# Altium schematic sheet FPGA_Actel_ProASICPlus_Evaluation_Board_Rev1_0.SchDoc: Example for Actel ProASIC+ Board
size B; DocumentNumber: 1; SheetNumber: 1; SheetTotal: 1
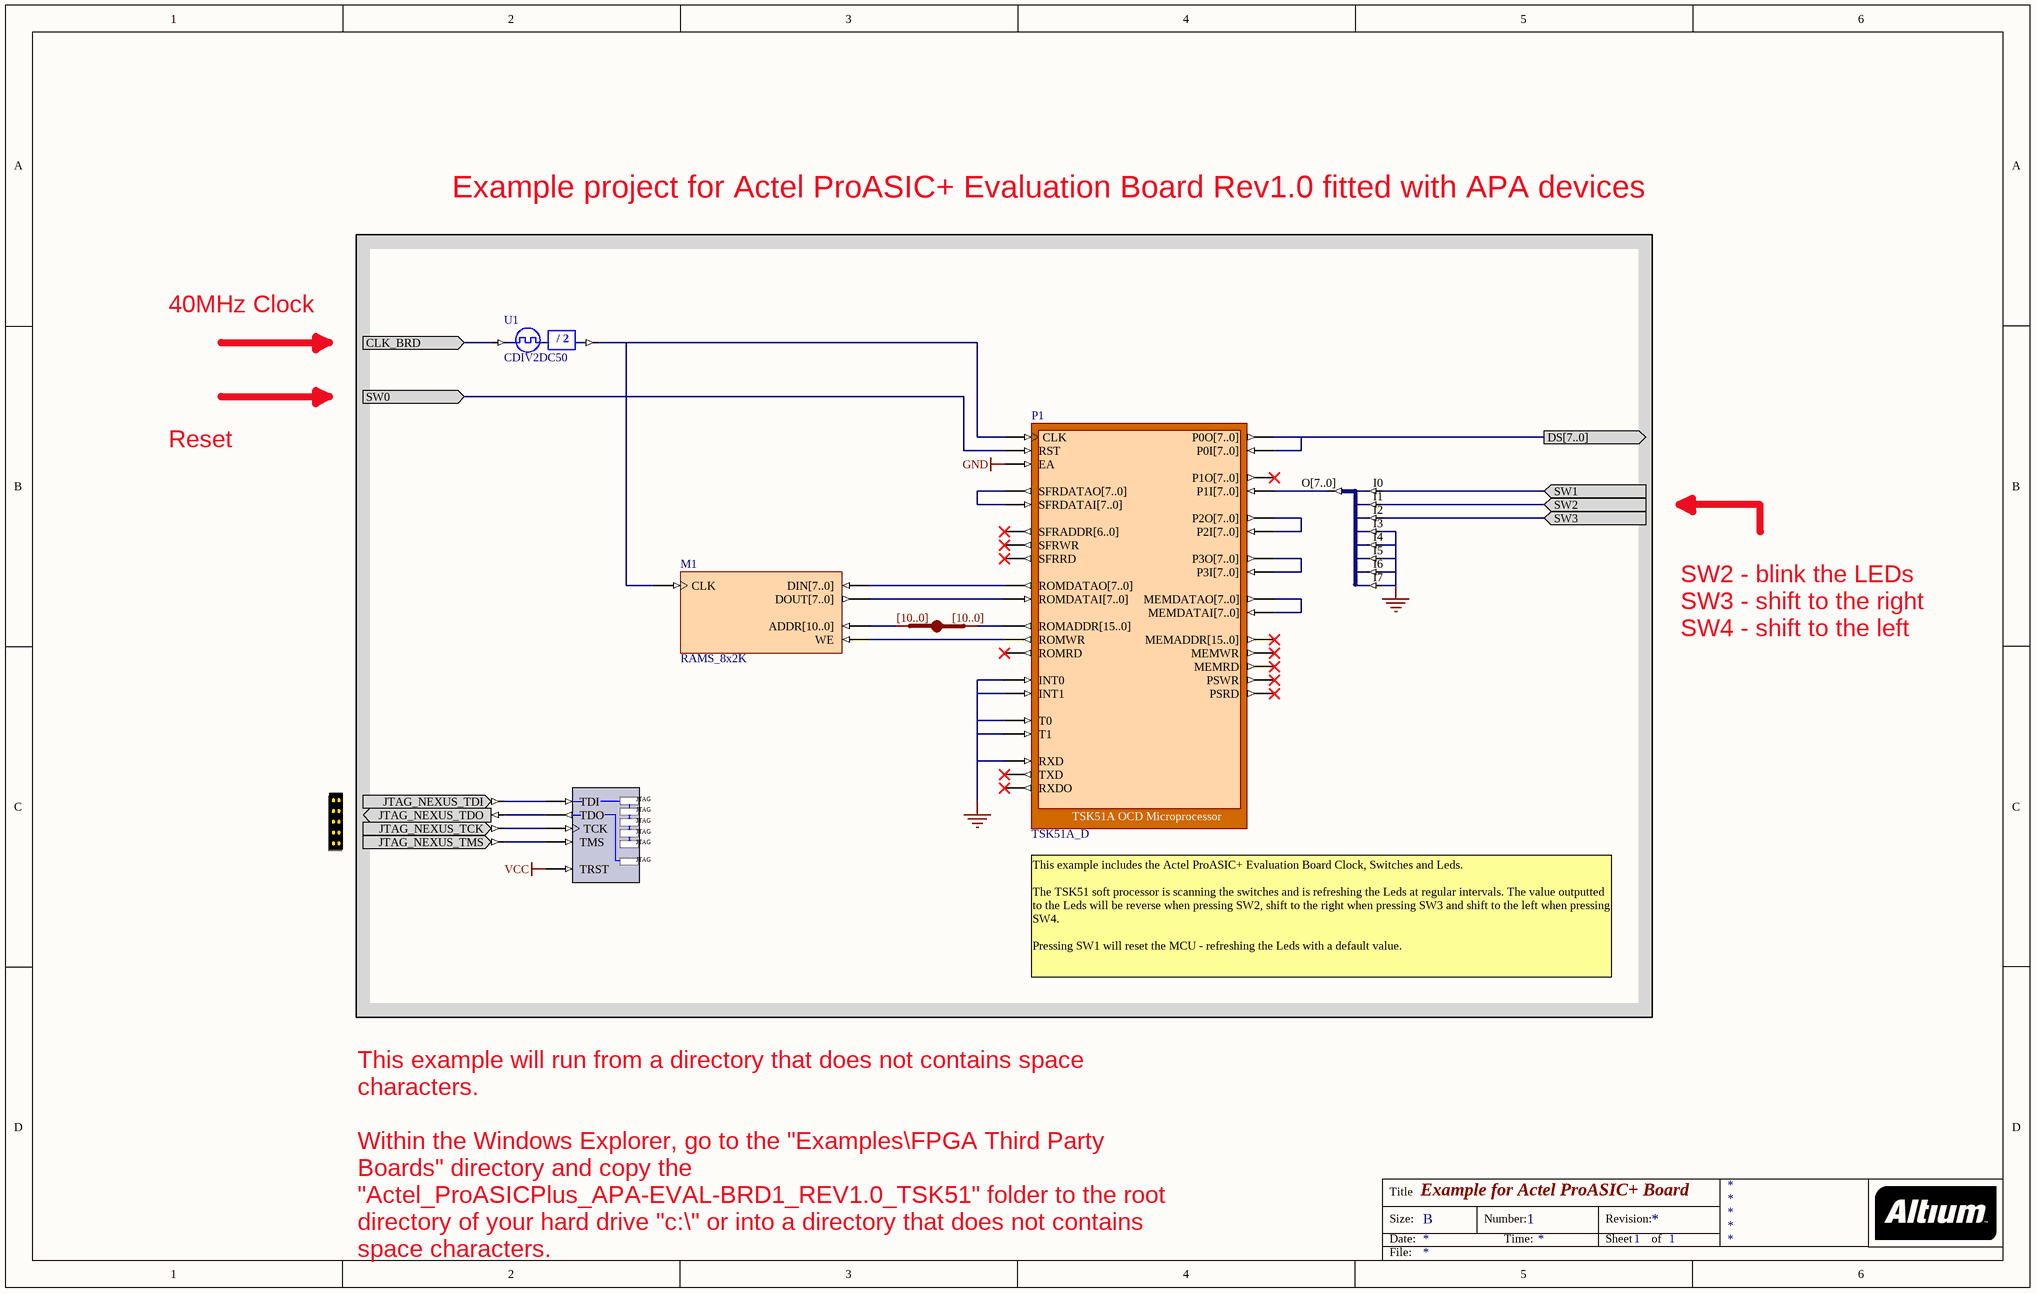
[diagram p0: FPGA_Actel_ProASICPlus_Evaluation_Board_Rev1_0.SchDoc]

## Parts
?  NEXUS_JTAG_CONNECTOR  (value not drawn)
JB_S1  IndexA: [10..0]  (hidden comment: JB)
M1  RAMS_8x2K
NEXUS_JTAG_PORT  NEXUS_JTAG_PORT  (value not drawn)
P1  TSK51A_D
U1  CDIV2DC50
U2  J8S_8B  (value not drawn)

## Ports
CLK_BRD (in), DS[7..0] (out), SW0 (in), SW1 (in), SW2 (in), SW3 (in)

## Nets
GND: P1.EA P1.INT0 P1.INT1 P1.RXD P1.T0 P1.T1 U2.I3 U2.I4 U2.I5 U2.I6 U2.I7
VCC: NEXUS_JTAG_PORT.TRST
CLK_BRD: U1.CLKIN ; port CLK_BRD
DS[7..0]: P1.P0I[7..0] P1.P0O[7..0] ; port DS[7..0]
SW0: P1.RST ; port SW0
SW1: U2.I0 ; port SW1
SW2: U2.I1 ; port SW2
SW3: U2.I2 ; port SW3
Net?_JTAG_NEXUS_TCK: ?.JTAG_NEXUS_TCK NEXUS_JTAG_PORT.TCK
Net?_JTAG_NEXUS_TDI: ?.JTAG_NEXUS_TDI NEXUS_JTAG_PORT.TDI
Net?_JTAG_NEXUS_TDO: ?.JTAG_NEXUS_TDO NEXUS_JTAG_PORT.TDO
Net?_JTAG_NEXUS_TMS: ?.JTAG_NEXUS_TMS NEXUS_JTAG_PORT.TMS
NetJB_S1_A[0..0]: JB_S1.A[0..0] M1.ADDR[10..0]
NetJB_S1_B[0..0]: JB_S1.B[0..0] P1.ROMADDR[15..0]
NetM1_CLK: M1.CLK P1.CLK U1.CLKDV
NetM1_DIN[7..0]: M1.DIN[7..0] P1.ROMDATAO[7..0]
NetM1_DOUT[7..0]: M1.DOUT[7..0] P1.ROMDATAI[7..0]
NetM1_WE: M1.WE P1.ROMWR
NetP1_MEMDATAI[7..0]: P1.MEMDATAI[7..0] P1.MEMDATAO[7..0]
NetP1_P1I[7..0]: P1.P1I[7..0] U2.O[7..0]
NetP1_P2I[7..0]: P1.P2I[7..0] P1.P2O[7..0]
NetP1_P3I[7..0]: P1.P3I[7..0] P1.P3O[7..0]
NetP1_SFRDATAI[7..0]: P1.SFRDATAI[7..0] P1.SFRDATAO[7..0]

Not connected (* = marked no-connect by the designer): P1 MEMADDR[15..0]* MEMRD* MEMWR* P1O[7..0]* PSRD* PSWR* ROMRD* RXDO* SFRADDR[6..0]* SFRRD* SFRWR* TXD*

## Notes on the sheet
- Example project for Actel ProASIC+ Evaluation Board Rev1.0 fitted with APA devices
- 40MHz Clock
- Reset
- SW2 - blink the LEDs
  SW3 - shift to the right
  SW4 - shift to the left
- This example includes the Actel ProASIC+ Evaluation Board Clock, Switches and Leds.
  The TSK51 soft processor is scanning the switches and is refreshing the Leds at regular intervals. The value outputted to the Leds will be reverse when pressing SW2, shift to the right when pressing SW3 and shift to the left when pressing SW4.
  Pressing SW1 will reset the MCU - refreshing the Leds with a default value.
- This example will run from a directory that does not contains space characters.
  Within the Windows Explorer, go to the "Examples\FPGA Third Party Boards" directory and copy the "Actel_ProASICPlus_APA-EVAL-BRD1_REV1.0_TSK51" folder to the root directory of your hard drive "c:\" or into a directory that does not contains space characters.
- Title
- Size:
- Date:
- B
- Number:
- Time:
- Revision:
- Sheet
- of
- File:
- (in symbol CDIV2DC50) / 2
- (in symbol NEXUS_JTAG_PORT) .

## Library data of the parts
? = NEXUS_JTAG_CONNECTOR: JTAG Port; PortComponent: True; Published: 19-Nov-2003; Publisher: Altium Limited; HelpURL: TR0102 NanoBoard Technical Reference Manual - NB1.pdf#page=33
JB_S1 = JB: System BUS Joiner; Published: 29-Jan-2004; Publisher: Altium Limited; LastRevisionNo: 1.00.00; HelpURL: CR0118 FPGA Generic Library Guide.pdf#page=296; FunctionalClass: Bus Joiner; IndexB: [10..0]
M1 = RAMS_8x2K: Single Port RAM; Memory_Depth: 2048; Memory_Type: RAM_SinglePortBlock; Memory_Width: 8; Memory_ClockEdge: Rising; Nexus_Core: Memory_Program; Memory_EnablePin: False; Published: 11/10/2004; Publisher: Altium Hobart Technology Center; Memory_ByteWrites: False
NEXUS_JTAG_PORT = NEXUS_JTAG_PORT: Soft Nexus-Chain Connector; NEXUS_JTAG_CONNECTOR: True; FunctionalClass: JTAG; Published: 29-Jan-2004; Publisher: Altium Limited; LastRevisionNo: 1.00.00; HelpURL: CR0118 FPGA Generic Library Guide.pdf#page=399
P1 = TSK51A_D: TSK51A OCD Microprocessor; NEXUS_CORE: Processor_OCDS; NEXUS_JTAG_DEVICE: True; NEXUS_JTAG_ORDER: 0; ChildModel1: RAM256x8_TSK51D; ChildCore1: M1; Published: 17-Nov-2004; Publisher: Altium Limited; ComponentLink1Description: Core &Resource Usage; ComponentLink1URL: CR0140 FPGA Processor Resource Usage.pdf#page=3; HelpURL: CR0115 TSK51x MCU.pdf#page=3; LastRevisionNo: 1.00.00; ComponentLink2Description: Embedded &Tools Guide; ComponentLink2URL: GU0107 Using the TSK51x TSK52x Embedded Tools.pdf; ComponentLink3Description: Embedded T&echnical References; ComponentLink3URL: TR0105 TSK51x TSK52x Embedded Tools Reference.pdf
U1 = CDIV2DC50: Clock Divider by 2 with 50% Duty Cycle Output; XilinxEquivalent: CLK_DIV2; DivisorRate: 2; DutyCycle: 50; ArchiveName: GENERIC; VHDLIB_SIM: GENERIC_LIB; Published: 29-Jan-2004; Publisher: Altium Limited; LastRevisionNo: 1.00.00; HelpURL: CR0118 FPGA Generic Library Guide.pdf#page=142; ComponentLink1URL: CR0127 FPGA Clock Divider Resource Usage.pdf#page=3; ComponentLink1Description: Core &Resource Usage; FunctionalClass: Clock Divider
U2 = J8S_8B: 8 Single pin inputs to single 8-Bit output bus; FunctionalClass: Bus Joiner; PortSize: 8; ArchiveName: GENERIC; VHDLIB_SIM: GENERIC_LIB; Published: 29-Jan-2004; Publisher: Altium Limited; LastRevisionNo: 1.00.00; HelpURL: CR0118 FPGA Generic Library Guide.pdf#page=305; ComponentLink1URL: CR0126 FPGA Bus Joiner Resource Usage.pdf#page=28; ComponentLink1Description: Core &Resource Usage